# Altium schematic sheet Connector.SchDoc
size A; SheetNumber: 6; SheetTotal: 7
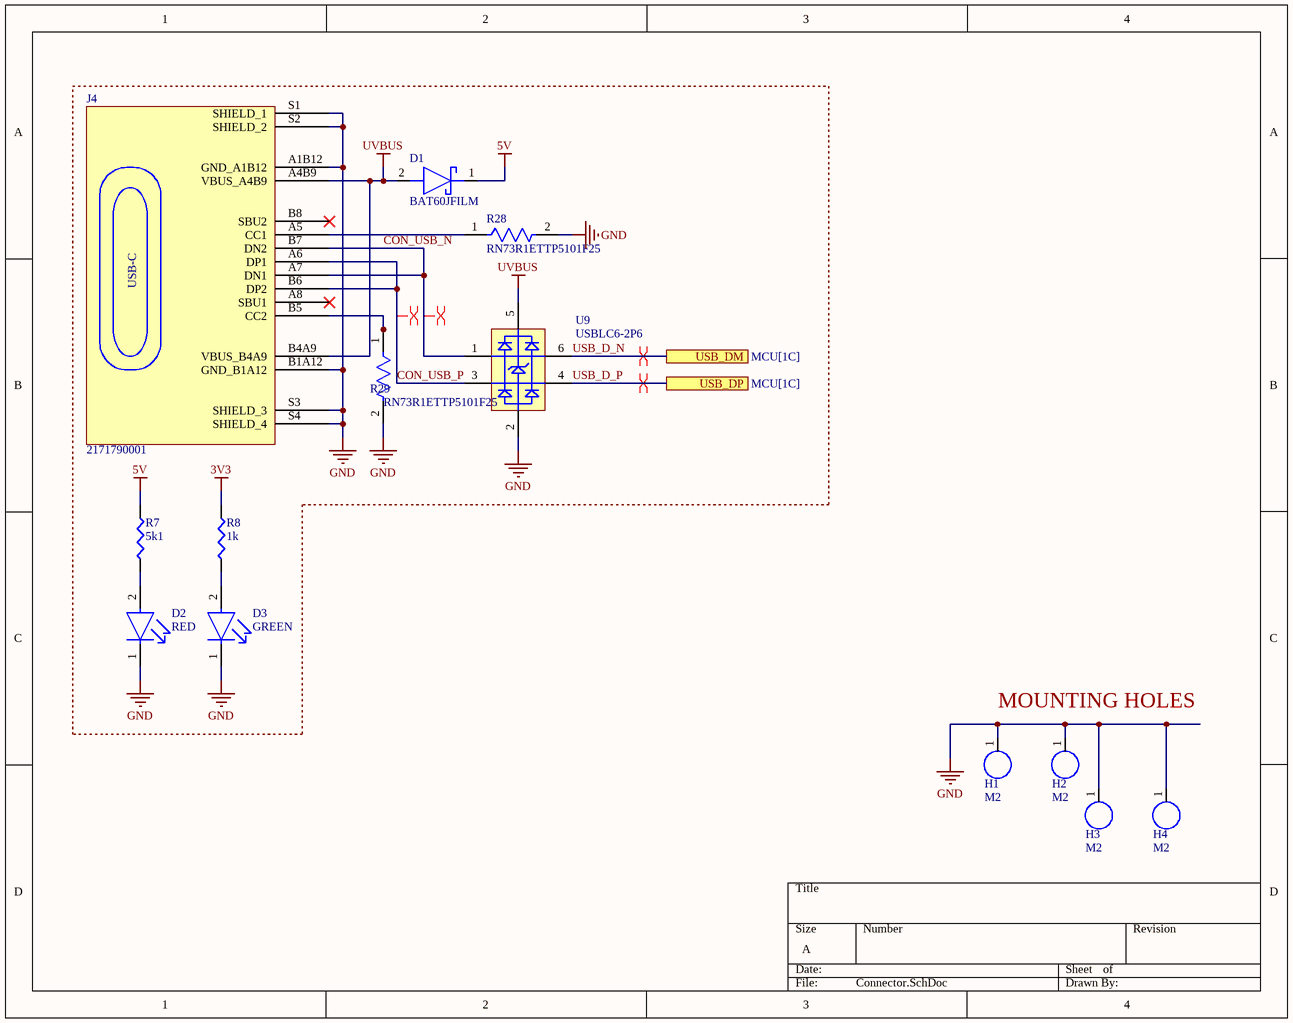
[diagram p0: Connector.SchDoc]

## Parts
D1  BAT60JFILM  [SOD2513X117N]
D2  RED  [LEDC1005X35N]
D3  GREEN  [LEDC1005X35N]
H1  M2  [Mounting Hole]
H2  M2  [Mounting Hole]
H3  M2  [Mounting Hole]
H4  M2  [Mounting Hole]
J4  2171790001  [FP-2171790001-MFG]
R7  5k1  [0402_R]
R8  1k  [0402_R]
R28  RN73R1ETTP5101F25  [FP-RN73R1E-IPC_C]
R29  RN73R1ETTP5101F25  [FP-RN73R1E-IPC_C]
U9  USBLC6-2P6  [USBLC62P6]

## Ports
USB_DM (see MCU[1C]), USB_DP (see MCU[1C])

## Nets
3V3: R8.2
5V: D1.1(K) R7.2
GND: D2.1(C) D3.1(C) H1.1 H2.1 H3.1 H4.1 J4.A1B12(GND_A1B12) J4.B1A12(GND_B1A12) J4.S1(SHIELD_1) J4.S2(SHIELD_2) J4.S3(SHIELD_3) J4.S4(SHIELD_4) R28.2 R29.2 U9.2(GND)
UVBUS: D1.2(A) J4.A4B9(VBUS_A4B9) J4.B4A9(VBUS_B4A9) U9.5(VBUS)
CON_USB_N: J4.A7(DN1) J4.B7(DN2) U9.1(I/O1_1)
CON_USB_P: J4.A6(DP1) J4.B6(DP2) U9.3(I/O2_1)
USB_D_N: U9.6(I/O1_2) ; port USB_DM
USB_D_P: U9.4(I/O2_2) ; port USB_DP
NetD2_2: D2.2(A) R7.1
NetD3_2: D3.2(A) R8.1
NetJ4_A5: J4.A5(CC1) R28.1
NetJ4_B5: J4.B5(CC2) R29.1

Not connected (* = marked no-connect by the designer): J4 A8(SBU1)* B8(SBU2)*

## Layout directives
differential pair; differential pair class DIFF 90: CON_USB_N, CON_USB_P
differential pair; differential pair class DIFF90: USB_D_N, USB_D_P

## Notes on the sheet
- MOUNTING HOLES
- (in symbol 217179-0001) USB-C

## Library data of the parts
D1 = D_Schotty_Diode: Diode Small Signal Schottky 10V 3A Automotive 2-Pin SOD-323 T/R; Manufacturer: STMicroelectronics; Element Configuration: Single; Forward Voltage: 320mV; Max Forward Surge Current (Ifsm): 5A; Max Junction Temperature (Tj): 150°C; Max Power Dissipation: 310mW; Max Reverse Leakage Current: 7.5µA; Number of Elements: 1; Peak Reverse Current: 2.5µA; Polarity: Standard; Supplier: DigiKey; Supplier Part Number: 497-3707-1-ND; Manufacturer Part Number: BAT60JFILM; RoHS: Compliant; Category: Schottky Diodes; Stock: 96297; Pricing: 1=0.29, 10=0.14, 100=0.1213, 500=0.08962, 1000=0.07938 (USD); Average Rectified Current: 3A; China RoHS: Compliant; Contact Plating: Tin; Current Rating: 3A; Forward Current: 3A; Height: 1.17mm; Lead Free: Lead Free; Length: 1.8mm; Lifecycle Status: Production; Max Operating Temperature: 150°C; Max Output current: 3A; Max Repetitive Reverse Voltage (Vrrm): 10V; Max Reverse Voltage (DC): 10V; Max Surge Current: 5A; Min Operating Temperature: -65°C; Mounting Technology: Surface Mount; Pins: 2; Number of Terminals: 2; Output Current: 3A; Packaging: Tape and Reel; Peak Non-Repetitive Surge Current: 5A; Radiation Hardening: No; REACH SVHC: Yes; Reverse Standoff Voltage: 10V; Schedule B: 8541100080, 8541100080|8541100080|8541100080|8541100080|8541100080|8541100080|8541100080|8541100080|8541100080|8541100080|8541100080|8541100080|8541100080|8541100080|8541100080|8541100080|8541100080|8541100080|8541100080|8541100080|8541100080|8541100080|8541100080|85; Voltage Rating (DC): 10V; Weight: 4.535924g; Width: 1.45mm; ComponentLink1URL: https://datasheet.octopart.com:443/BAT60JFILM-STMicroelectronics-datasheet-56177.pdf?src-supplier=STMicroelectronics; ComponentLink1Description: https://datasheet.octopart.com:443/BAT60JFILM-STMicroelectronics-datasheet-56177.pdf?src-supplier=STMicroelectronics; ComponentLink2URL: https://datasheet.octopart.com:443/BAT60JFILM-STMicroelectronics-datasheet-12532682.pdf?src-supplier=TME; ComponentLink2Description: https://datasheet.octopart.com:443/BAT60JFILM-STMicroelectronics-datasheet-12532682.pdf?src-supplier=TME; ComponentLink3URL: https://datasheet.octopart.com:443/BAT60JFILM-STMicroelectronics-datasheet-181242469.pdf?src-supplier=Newark; ComponentLink3Description: https://datasheet.octopart.com:443/BAT60JFILM-STMicroelectronics-datasheet-181242469.pdf?src-supplier=Newark; ComponentLink4URL: https://datasheet.octopart.com:443/BAT60JFILM-STMicroelectronics-datasheet-14054140.pdf?src-supplier=iiiC; ComponentLink4Description: https://datasheet.octopart.com:443/BAT60JFILM-STMicroelectronics-datasheet-14054140.pdf?src-supplier=iiiC; LCSC Part #: C133103
D2 = D_RED_LED: RED LED; LCSC Part #: C397045
D3 = D_GREEN_LED: Green LED; LCSC Part #: C434446
H1-H4 = M2 Mounting Hole: 2mm M2 Mounting Hole
J4 = 217179-0001: CONN RCP USB2.0 TYP C 24P SMD RA; Manufacturer: Molex; Supplier: Digikey; Supplier Part Number: 900-2171790001CT-ND; Manufacturer Part Number: 217179-0001; RoHS: No; Category: Connectors; Stock: 11294; Pricing: 1=0.98, 10=0.731, 25=0.6564, 50=0.6074, 100=0.5642, 250=0.51468, 500=0.48234, 1200=0.44689, 2400=0.42258, 3600=0.40973, 6000=0.39484, 8400=0.38577, 12000=0.37675 (USD); LCSC Part #: C3197684
R7 = R_5K1_0402: Res Thick Film 0402 5.1K Ohm 1% 0.063W(1/16W) ±100ppm/C Pad SMD T/R; Manufacturer: Yageo Group; Manufacturer Part Number: RC0402FR-135K1L; Power Dissipation: 62.5mW; Value: 5.1kΩ; Temperature Coefficient: 100ppm/°C; Voltage Rating: 50V; Supplier: DigiKey; Supplier Part Number: 13-RC0402FR-135K1LCT-ND; RoHS: Compliant; Category: Chip SMD Resistors; Stock: 220857; Pricing: 1=0.1, 10=0.005, 25=0.0044, 50=0.004, 100=0.0036, 250=0.00328 (USD); Case/Package: 0402; Case Code (Imperial): 0402; Case Code (Metric): 1005; China RoHS: Non-Compliant; Composition: Thick Film; Contact Plating: Tin; Height: 350µm; Length: 1mm; Lifecycle Status: Production; Max Operating Temperature: 155°C; Min Operating Temperature: -55°C; Mounting Technology: Surface Mount; Number of Terminals: 2; Packaging: Tape & Reel; Power Rating: 62.5mW; Radiation Hardening: No; REACH SVHC: Yes; Termination: SMD/SMT; Tolerance: 1%; Width: 500µm; Working Voltage: 50V; ComponentLink1URL: https://datasheet.octopart.com:443/RC0402FR-135K1L-Yageo-datasheet-175887523.pdf?src-supplier=IHS; ComponentLink1Description: https://datasheet.octopart.com:443/RC0402FR-135K1L-Yageo-datasheet-175887523.pdf?src-supplier=IHS; ComponentLink2URL: https://datasheet.octopart.com:443/RC0402FR-135K1L-Yageo-datasheet-164759695.pdf?src-supplier=Future+Electronics; ComponentLink2Description: https://datasheet.octopart.com:443/RC0402FR-135K1L-Yageo-datasheet-164759695.pdf?src-supplier=Future+Electronics; ComponentLink3URL: https://datasheet.octopart.com/RC0402FR-135K1L-Yageo-datasheet-73766026.pdf; ComponentLink3Description: https://datasheet.octopart.com/RC0402FR-135K1L-Yageo-datasheet-73766026.pdf; ComponentLink4URL: https://datasheet.octopart.com:443/RC0402FR-135K1L-Yageo-datasheet-10408619.pdf?src-supplier=_legacy+Avnet; ComponentLink4Description: https://datasheet.octopart.com:443/RC0402FR-135K1L-Yageo-datasheet-10408619.pdf?src-supplier=_legacy+Avnet; ComponentLink5URL: http://sigma.octopart.com:80/rohs_statement/Yageo-company-2.pdf?src-supplier=Compliance+Statements; ComponentLink5Description: http://sigma.octopart.com:80/rohs_statement/Yageo-company-2.pdf?src-supplier=Compliance+Statements; ComponentLink6URL: http://sigma.octopart.com:80/conflict_mineral_statement/Yageo-company-3.pdf?src-supplier=Compliance+Statements; ComponentLink6Description: http://sigma.octopart.com:80/conflict_mineral_statement/Yageo-company-3.pdf?src-supplier=Compliance+Statements; LCSC Part #: C4346772
R8 = R_1k_0402: RES 1K OHM 1% 1/16W 0402; Manufacturer: Yageo Group; Manufacturer Part Number: RC0402FR-071KL; Power Dissipation: 62.5mW; Power Rating: 63mW; Value: 1kΩ; Temperature Coefficient: 100ppm/°C; Voltage Rating: 50V; LCSC Part #: C106235; Supplier: DigiKey; Supplier Part Number: 311-1.00KLRTR-ND; RoHS: Compliant; Category: Chip SMD Resistors; Stock: 4926888; Pricing: 10000=0.00204, 20000=0.002, 30000=0.00196, 50000=0.00182, 70000=0.00181 (USD); Case/Package: 0402; Case Code (Imperial): 0402; Case Code (Metric): 0402; China RoHS: Non-Compliant; Composition: Thick Film; Depth: 500µm; Height: 350µm; Lead Free: Lead Free; Length: 1mm; Lifecycle Status: Production; Max Operating Temperature: 155°C; Military Standard: Not; Min Operating Temperature: -55°C; Mounting Technology: Surface Mount; Pins: 2; Number of Terminals: 2; Packaging: Tape & Reel; REACH SVHC: Yes; Schedule B: 8533210045, 8533210045|8533210045|8533210045|8533210045|8533210045|8533210045|8533210045|8533210045|8533210045|8533210045|8533210045|8533210045|8533210045|8533210045|8533210045|8533210045|8533210045|8533210045|8533210045|8533210045|8533210045|8533210045|8533210045|85; Termination: SMD/SMT; Tolerance: 1%; Voltage Rating (AC): 50V; Voltage Rating (DC): 50V; Width: 500µm; Working Voltage: 50V; ComponentLink1URL: https://datasheet.octopart.com:443/RC0402FR-071KL-Yageo-datasheet-175887523.pdf?src-supplier=IHS; ComponentLink1Description: https://datasheet.octopart.com:443/RC0402FR-071KL-Yageo-datasheet-175887523.pdf?src-supplier=IHS; ComponentLink2URL: https://datasheet.octopart.com:443/RC0402FR-071KL-Yageo-datasheet-164759695.pdf?src-supplier=Upverter; ComponentLink2Description: https://datasheet.octopart.com:443/RC0402FR-071KL-Yageo-datasheet-164759695.pdf?src-supplier=Upverter; ComponentLink3URL: https://datasheet.octopart.com:443/RC0402FR-071KL-Yageo-datasheet-103092701.pdf?src-supplier=Upverter; ComponentLink3Description: https://datasheet.octopart.com:443/RC0402FR-071KL-Yageo-datasheet-103092701.pdf?src-supplier=Upverter; ComponentLink4URL: https://sigma.octopart.com:443/138820526/technical_drawing/Yageo-RC0402FR-071KL.pdf?src-supplier=Upverter; ComponentLink4Description: https://sigma.octopart.com:443/138820526/technical_drawing/Yageo-RC0402FR-071KL.pdf?src-supplier=Upverter; ComponentLink5URL: https://datasheet.octopart.com:443/RC0402FR-071KL-Yageo-datasheet-98239111.pdf?src-supplier=Upverter; ComponentLink5Description: https://datasheet.octopart.com:443/RC0402FR-071KL-Yageo-datasheet-98239111.pdf?src-supplier=Upverter; ComponentLink6URL: https://datasheet.octopart.com:443/RC0402FR-071KL-Yageo-datasheet-10408619.pdf?src-supplier=Newark; ComponentLink6Description: https://datasheet.octopart.com:443/RC0402FR-071KL-Yageo-datasheet-10408619.pdf?src-supplier=Newark; ComponentLink7URL: https://datasheet.octopart.com:443/RC0402FR-071KL-Yageo-datasheet-8324527.pdf?src-supplier=Newark; ComponentLink7Description: https://datasheet.octopart.com:443/RC0402FR-071KL-Yageo-datasheet-8324527.pdf?src-supplier=Newark; ComponentLink8URL: https://datasheet.octopart.com:443/RC0402FR-071KL-Yageo-datasheet-62067350.pdf?src-supplier=Farnell; ComponentLink8Description: https://datasheet.octopart.com:443/RC0402FR-071KL-Yageo-datasheet-62067350.pdf?src-supplier=Farnell; ComponentLink9URL: https://datasheet.octopart.com:443/RC0402FR-071KL-Yageo-datasheet-12531192.pdf?src-supplier=Future+Electronics; ComponentLink9Description: https://datasheet.octopart.com:443/RC0402FR-071KL-Yageo-datasheet-12531192.pdf?src-supplier=Future+Electronics; ComponentLink10URL: https://datasheet.octopart.com:443/RC0402FR-071KL-Yageo-datasheet-137700087.pdf?src-supplier=Future+Electronics; ComponentLink10Description: https://datasheet.octopart.com:443/RC0402FR-071KL-Yageo-datasheet-137700087.pdf?src-supplier=Future+Electronics; ComponentLink11URL: https://datasheet.octopart.com:443/RC0402FR-071KL-Yageo-datasheet-8324255.pdf?src-supplier=Future+Electronics; ComponentLink11Description: https://datasheet.octopart.com:443/RC0402FR-071KL-Yageo-datasheet-8324255.pdf?src-supplier=Future+Electronics; ComponentLink12URL: https://datasheet.octopart.com:443/RC0402FR-071KL-Yageo-datasheet-8329306.pdf?src-supplier=element14; ComponentLink12Description: https://datasheet.octopart.com:443/RC0402FR-071KL-Yageo-datasheet-8329306.pdf?src-supplier=element14; ComponentLink13URL: https://datasheet.octopart.com:443/RC0402FR-071KL-Yageo-datasheet-505231.pdf?src-supplier=element14; ComponentLink13Description: https://datasheet.octopart.com:443/RC0402FR-071KL-Yageo-datasheet-505231.pdf?src-supplier=element14; ComponentLink14URL: https://datasheet.octopart.com:443/RC0402FR-071KL-Yageo-datasheet-175423674.pdf?src-supplier=SOS+electronic; ComponentLink14Description: https://datasheet.octopart.com:443/RC0402FR-071KL-Yageo-datasheet-175423674.pdf?src-supplier=SOS+electronic; ComponentLink15URL: https://datasheet.octopart.com:443/RC0402FR-071KL-Yageo-datasheet-148775077.pdf?src-supplier=TME; ComponentLink15Description: https://datasheet.octopart.com:443/RC0402FR-071KL-Yageo-datasheet-148775077.pdf?src-supplier=TME; ComponentLink16URL: https://datasheet.octopart.com:443/RC0402FR-071KL-Yageo-datasheet-79472498.pdf?src-supplier=Megastar; ComponentLink16Description: https://datasheet.octopart.com:443/RC0402FR-071KL-Yageo-datasheet-79472498.pdf?src-supplier=Megastar; ComponentLink17URL: https://datasheet.octopart.com/RC0402FR-071KL-Yageo-datasheet-73766026.pdf; ComponentLink17Description: https://datasheet.octopart.com/RC0402FR-071KL-Yageo-datasheet-73766026.pdf; ComponentLink18URL: http://sigma.octopart.com:80/rohs_statement/Yageo-company-2.pdf?src-supplier=Compliance+Statements; ComponentLink18Description: http://sigma.octopart.com:80/rohs_statement/Yageo-company-2.pdf?src-supplier=Compliance+Statements; ComponentLink19URL: http://sigma.octopart.com:80/conflict_mineral_statement/Yageo-company-3.pdf?src-supplier=Compliance+Statements; ComponentLink19Description: http://sigma.octopart.com:80/conflict_mineral_statement/Yageo-company-3.pdf?src-supplier=Compliance+Statements
R28 R29 = CMP-04015-008529-1: 5.1kΩ ±1% 0.063W, 1/16W Chip Resistor 0402 (1005 Metric) Moisture Resistant Thin Film
U9 = USBLC6-2P6: Integrated Circuit; Manufacturer_Name: STMicroelectronics; Datasheet Link: https://datasheet.lcsc.com/szlcsc/STMicroelectronics-USBLC6-2P6_C15999.pdf; Height: 0.6mm; Manufacturer_Part_Number: USBLC6-2P6; Mouser Part Number: 511-USBLC6-2P6; Mouser Price/Stock: https://www.mouser.co.uk/ProductDetail/STMicroelectronics/USBLC6-2P6?qs=6ARB0lp6jlViGcbUSvj1Mw%3D%3D; Arrow Part Number: USBLC6-2P6; Arrow Price/Stock: https://www.arrow.com/en/products/usblc6-2p6/stmicroelectronics?utm_currency=USD&region=europe; LCSC Part #: C15999